# Altium project Amplificateur_instrumentation_E2026.PrjPcb
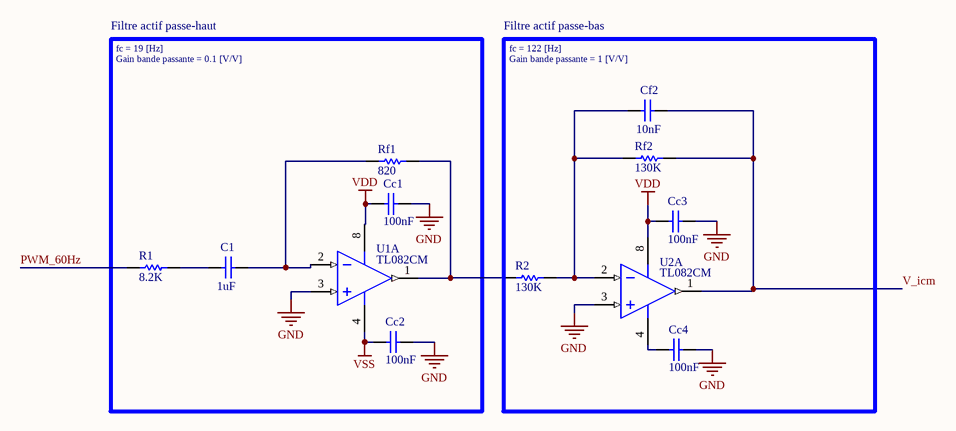
[diagram p0: Filtres_PWM_Generateur_Bruit.SchDoc]
1 sheet, 12 parts. Net scope: global (net labels, ports and power ports of the same name join across sheets).

## Sheet Filtres_PWM_Generateur_Bruit.SchDoc
size A4; SheetNumber: 1; SheetTotal: 1; SPICEModelCacheLZUXPCKQ: <root> / <DocumentId>LZUXPCKQ</DocumentId> / <CacheFrame Number="0"> / <Model Name="lf353" Kind="CKT"> / <Text>*////////////////////////////////////////////////////////// / *LF353 Wide Bandwidth Dual JFET-Input OP-AMP MACRO-MODEL / *////////////////////////////////////////////////////////// / * / * connections:    non-inverting input / *                 |   inverting input / *                 |   |   positive power supply / *                 |   |   |   negative power supply / *                 |   |   |   |   output / *                 |   |   |   |   | / *                 |   |   |   |   | / .SUBCKT LF353     1   2  99  50  28 / * / * PINOUT ORDER +IN -IN V+ V- OUT / * / * / *Features: / *Low supply current =                1.8mA / *Wide bandwidth =                     4MHz / *High slew rate =                   13V/uS / *Low offset voltage =                 10mV / * / *NOTE: Model is for single device only and simulated / *      supply current is 1/2 of total device current. / * / ****************INPUT STAGE************** / * / IOS 2 1 25P / *^Input offset current / R1 1 3 1E12 / R2 3 2 1E12 / I1 99 4 100U / J1 5 2 4 JX / J2 6 7 4 JX / R3 5 50 20K / R4 6 50 20K / *Fp2=12 MHz / C4 5 6 3.31573E-13 / * / ***********COMMON MODE EFFECT*********** / * / I2 99 50 1.7MA / *^Quiescent supply current / EOS 7 1 POLY(1) 16 49 5E-3 1 / *Input offset voltage.^ / R8 99 49 50K / R9 49 50 50K / * / *********OUTPUT VOLTAGE LIMITING******** / V2 99 8 2.13 / D1 9 8 DX / D2 10 9 DX / V3 10 50 2.13 / * / **************SECOND STAGE************** / * / EH 99 98 99 49 1 / F1 9 98 POLY(1) VA3 0 0 0 1.0985E7 / G1 98 9 5 6 1E-3 / R5 98 9 100MEG / VA3 9 11 0 / *Fp1=40.3 HZ / C3 98 11 39.493P / * / ***************POLE STAGE*************** / * / *Fp3=42 MHz / G3 98 15 9 49 1E-6 / R12 98 15 1MEG / C5 98 15 3.7894E-15 / * / *********COMMON-MODE ZERO STAGE********* / * / G4 98 16 3 49 1E-8 / L2 98 17 31.831M / R13 17 16 1K / * / **************OUTPUT STAGE************** / * / F6  99 50 VA7 1 / F5  99 23 VA8 1 / D5  21 23 DX / VA7 99 21 0 / D6  23 99 DX / E1  99 26 99 15 1 / VA8 26 27 0 / R16 27 28 35 / V5  28 25 0.1V / D4  25 15 DX / V4  24 28 0.1V / D3  15 24 DX / * / ***************MODELS USED************** / * / .MODEL DX D(IS=1E-15) / .MODEL JX PJF(BETA=1.25E-5 VTO=-2.00 IS=50E-12) / * / .ENDS</Text> / </Model> / </CacheFrame> / </root>

### Parts
C1  Capacitance: 1uF  [KEMT-C333C105M5U5TA-2]  (hidden comment: C333C105M5U5TA)
Cc1  value 100nF  [RAD-0.3]  (hidden comment: Cap)
Cc2  value 100nF  [RAD-0.3]  (hidden comment: Cap)
Cc3  value 100nF  [RAD-0.3]  (hidden comment: Cap)
Cc4  value 100nF  [RAD-0.3]  (hidden comment: Cap)
Cf2  Capacitance: 10nF  [KEMT-C333C105M5U5TA-2]  (hidden comment: C333C105M5U5TA)
R1  value 8.2K  [AXIAL-0.3]  (hidden comment: Res1)
R2  value 130K  [AXIAL-0.3]  (hidden comment: Res1)
Rf1  value 820  [AXIAL-0.3]  (hidden comment: Res1)
Rf2  value 130K  [AXIAL-0.3]  (hidden comment: Res1)
U1  TL082CM  [M08A_N]  (part A of 2)
U2  TL082CM  [M08A_N]  (part A of 2)

### Blocks framed on the sheet
Filtre actif passe-haut: C1 Cc1 Cc2 R1 Rf1 U1
Filtre actif passe-bas: Cc3 Cc4 Cf2 R2 Rf2 U2

### Nets
GND: Cc1.2 Cc2.2 Cc3.2 Cc4.2 U1.3(INA+) U2.3(INA+)
VDD: Cc1.1 Cc3.1 U1.8(V+) U2.8(V+)
VSS: Cc2.1 U1.4(V-)
PWM_60Hz: R1.1
V_icm: Cf2.2 Rf2.2 U2.1(OUTA)
NetC1_1: C1.1 R1.2
NetC1_2: C1.2 Rf1.1 U1.2(INA-)
NetCc4_1: Cc4.1 U2.4(V-)
NetCf2_1: Cf2.1 R2.2 Rf2.1 U2.2(INA-)
NetR2_1: R2.1 Rf1.2 U1.1(OUTA)

### Notes on the sheet
- fc = 19 [Hz]
- Gain bande passante = 0.1 [V/V]
- fc = 122 [Hz]
- (near Cf2) Gain bande passante = 1 [V/V]

### Library data of the parts
C1 = CMP-2000-05174-1: Multilayer Ceramic Capacitor / Axial and Radial Leaded, 1 uF, +/- 20%, 10 to 85 degC, 2-Pin THD, RoHS, Bulk; Manufacturer: Kemet; Voltage Rating: 50V; Temperature Coefficient / Code: Z5U; Case Height: 3.81mm; Lead Diameter: 0.51mm; Case Style: ConformallyCoated; Dissipation Factor DF: 4; Case Length: 9.91mm; Type: RadialLeads; Case Width: 7.62mm; Dimensions: 7.62mmWx9.91mmLx3.81mmH; Termination Style: Radial; Factory Pack Quantity: 250; Packaging: Bulk; RoHS: Details; Datasheet Version: Jul-09; Lead Spacing: 5.08mm; Product Category: MultilayerCeramicCapacitorsMLCC-Leaded; Maximum Operating Temperature: +125C; Product: GeneralTypeMLCCs; Manufacturer URL: http://www.kemet.com/; Lead Style: InsideBend; Operating Temperature Range: -55Cto+125C; Datasheet URL: http://www.farnell.com/datasheets/706880.pdf; Voltage Rating DC: 50V; Brand: Kemet; Series: C333; Tolerance: 20%; Minimum Operating Temperature: -55C
Cc1-Cc4 = Cap: Capacitor; Published: 8-Jun-2000; LatestRevisionDate: 17-Jul-2002; LatestRevisionNote: Re-released for DXP Platform.; PackageReference: RAD-0.3; Publisher: Altium Limited; PackageDescription: Radial Cap, Thru-Hole; 2 Leads; 0.3 in Pin Spacing
Cf2 = CMP-2000-05174-1: Multilayer Ceramic Capacitor / Axial and Radial Leaded, 1 uF, +/- 20%, 10 to 85 degC, 2-Pin THD, RoHS, Bulk; Manufacturer: Kemet; Voltage Rating: 50V; Temperature Coefficient / Code: Z5U; Case Height: 3.81mm; Lead Diameter: 0.51mm; Case Style: ConformallyCoated; Dissipation Factor DF: 4; Case Length: 9.91mm; Case Width: 7.62mm; Dimensions: 7.62mmWx9.91mmLx3.81mmH; Termination Style: Radial; Factory Pack Quantity: 250; Packaging: Bulk; RoHS: Details; Datasheet Version: Jul-09; Lead Spacing: 5.08mm; Product Category: MultilayerCeramicCapacitorsMLCC-Leaded; Maximum Operating Temperature: +125C; Product: GeneralTypeMLCCs; Manufacturer URL: http://www.kemet.com/; Lead Style: InsideBend; Operating Temperature Range: -55Cto+125C; Type: RadialLeads; Datasheet URL: http://www.farnell.com/datasheets/706880.pdf; Voltage Rating DC: 50V; Brand: Kemet; Series: C333; Tolerance: 20%; Minimum Operating Temperature: -55C
R1 R2 Rf1 Rf2 = Res1: Resistor; Published: 8-Jun-2000; LatestRevisionDate: 17-Jul-2002; LatestRevisionNote: Re-released for DXP Platform.; PackageReference: AXIAL-0.3; Publisher: Altium Limited; PackageDescription: Axial Device, Thru-Hole; 2 Leads; 0.3 in Pin Spacing
U1 U2 = TL082CM: Wide Bandwidth Dual JFET Input Operational Amplifier, 8-pin Narrow SOIC; Manufacturer: National Semiconductor; PackageTopMarking: NSZXTT*TL*082CM; PowerWise: N; CompType: Amplifiers; Published: 4-Dec-2008; LatestRevisionDate: 13-Jan-2009; LatestRevisionNote: Sim Model Added.; DatasheetVersion: Aug-2000; PackageVersion: revM, May-2009; PackageReference: M08A; Publisher: Altium Limited; PackageDescription: SOIC Narrow, 4.9 x 3.9 x 1.45mm, 8 Lead, 1.27mm Pitch; Supplier 1: Digi-Key; Supplier Part Number 1: TL082CM-ND; PartNumber: TL082CM; RoHS: N; PinCount: 8; Code_JEDEC: MS-012-AA; Code_IPC: SOIC127P600-8; ComponentLink1Description: TL082 Datasheet; ComponentLink1URL: http://www.national.com/ds/TL/TL082.pdf; ComponentLink2Description: TL082 Web Page; ComponentLink2URL: http://www.national.com/pf/TL/TL082.html; ComponentLink3Description: M08A Package Page; ComponentLink3URL: http://www.national.com/packaging/folders/m08a.html